# Altium schematic sheet Output.SchDoc
size A4; SheetNumber: 3; SheetTotal: 4
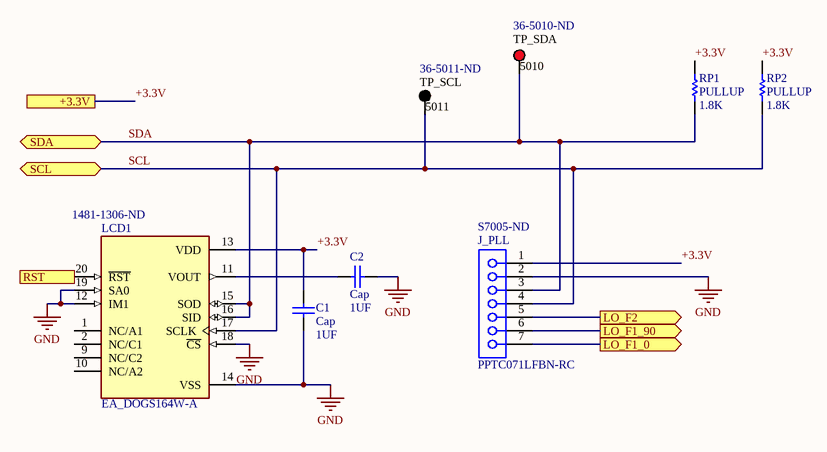
[diagram p0: Output.SchDoc]

## Parts
C1  Cap  value 1UF  [RADIAL-0.1]
C2  Cap  value 1UF  [RADIAL-0.1]
J_PLL  PPTC071LFBN-RC  Supplier Part Number 1: S7005-ND  [SMTC-SSQ-107-01-X-S]
LCD1  EA_DOGS164W-A  Supplier Part Number 1: 1481-1306-ND  [LCD_EA_DOGS164W-A]
RP1  PULLUP  value 1.8K  [AXIAL-0.1-RES]
RP2  PULLUP  value 1.8K  [AXIAL-0.1-RES]
TP_SCL  5011  Supplier Part Number 1: 36-5011-ND  [KSTN-5011_V]
TP_SDA  5010  Supplier Part Number 1: 36-5010-ND  [KSTN-5010_V]

## Ports
+3.3V, LO_F1_0 (out), LO_F1_90 (out), LO_F2 (out), RST (in), SCL (bidir), SDA (bidir)

## Nets
GND: C1.1 C2.1 J_PLL.2 LCD1.12(IM1) LCD1.14(VSS) LCD1.18(~{CS}) LCD1.19(SA0)
+3.3V: C1.2 J_PLL.1 LCD1.13(VDD) RP1.2 RP2.2 ; port +3.3V
LO_F1_0: J_PLL.7 ; port LO_F1_0
LO_F1_90: J_PLL.6 ; port LO_F1_90
LO_F2: J_PLL.5 ; port LO_F2
RST: LCD1.20(~{RST}) ; port RST
SCL: J_PLL.4 LCD1.17(SCLK) RP2.1 TP_SCL.1 ; port SCL
SDA: J_PLL.3 LCD1.15(SOD) LCD1.16(SID) RP1.1 TP_SDA.1 ; port SDA
NetC2_2: C2.2 LCD1.11(VOUT)

Not connected (* = marked no-connect by the designer): LCD1 1(NC/A1) 2(NC/C1) 9(NC/C2) 10(NC/A2)

## Library data of the parts
C1 C2 = CAP ALUM 1UF 20% 100V RADIAL: Capacitor; Manufacturer Part Number: ESE105M100AC3EA; Designator: C?; Voltage Rating: 100V; Published: 8-Jun-2000; LatestRevisionDate: 17-Jul-2002; LatestRevisionNote: Re-released for DXP Platform.; Publisher: Altium Limited
J_PLL = CMP-1023-00284-1: SQ Post Socket, Through-hole, Vertical, -55 to 125 degC, 2.54 mm Pitch, 7-Pin, Female, RoHS; PartNumber: SSQ-107-01-G-S; Manufacturer: Samtec; Manufacturer Series: PP; Pitch: 2.54 mm; Description: Board Connector, 7 Contact(s), 1 Row(s), Female, Straight, 0.1 inch Pitch, Solder Terminal, Locking; Connector Type: BOARD CONNECTOR; Contact Pattern: RECTANGULAR; Contact Style: SQ PIN-SKT; Number Of Connectors: 1; Polarization Key: POLARIZED HOUSING; Rated Current (Signal): 3A; Number of Contacts: 7; Body Breadth: 0.094inch; Body Depth: 0.334inch; Body Length: 0.72inch; Mating Contact Pitch: 0.1inch; Mounting Option 1: LOCKING; Reference Standard: UL; Reliability: COMMERCIAL; PackageDescription: Assembly, Socket Strip .025[0.64] SQ Tail; PackageReference: SSQ-107-01-X-S; ComponentLink2URL: http://www.samtec.com/documents/webfiles/pdf/SSQ_TH.PDF; ComponentLink1URL: http://www.samtec.com; ComponentLink3Description: Package Specification; PackageVersion: BD, 6/1987; RoHS: True; DatasheetVersion: F-214; Mounting Technology: Through-hole; ComponentLink3URL: http://www.samtec.com/documents/webfiles/cpdf/SSQ-1XX-XX-XXX-X-XX-XXX-XX-X-MKT.pdf; ComponentLink1Description: Manufacturer URL; Temperature Range: -55 to 125 degC; Orientation: Vertical; ComponentLink2Description: Datasheet; Supplier 1: Digikey; Manufacturer Part Number: PPTC071LFBN-RC; Category: Connectors; Stock 1: 11503; Pricing 1: 1=0.6, 10=0.52, 80=0.42913, 440=0.37309, 1000=0.30781, 5000=0.2705, 10000=0.2665 (USD); Mount: Board; Contact Material: Bronze; Contact Finish - Mating: SN; Contact Finish - Termination: TIN; Insulation Material: Polyester; Contact Gender: Female; Mounting Style: STRAIGHT; Number Of PCB Rows: 1; Number of Rows Loaded: 1; PCB Contact Pattern: RECTANGULAR; Termination: Solder; Terminal Length: 0.125inch; Terminal Pitch: 2.54mm; Reach SVHC Compliant: Yes; RoHS Compliant: Yes; ComponentLink4URL: https://datasheet.ciiva.com:443/pdfs/VipMasterIC/IC/SUCS/SUCSS00270/SUCSS00270-1.pdf?src-supplier=IHS+Markit; ComponentLink4Description: https://datasheet.ciiva.com:443/pdfs/VipMasterIC/IC/SUCS/SUCSS00270/SUCSS00270-1.pdf?src-supplier=IHS+Markit; ComponentLink5URL: https://media.digikey.com/pdf/Data%20Sheets/Sullins%20PDFs/Female_Headers.100_DS.pdf?src-supplier=Digikey; ComponentLink5Description: https://media.digikey.com/pdf/Data%20Sheets/Sullins%20PDFs/Female_Headers.100_DS.pdf?src-supplier=Digikey; ComponentLink6URL: http://www.sullinscorp.com/catalogs/78_Page80-81_HEADER_.100_2.54mm_FEMALE.pdf?src-supplier=Future+Electronics; ComponentLink6Description: http://www.sullinscorp.com/catalogs/78_Page80-81_HEADER_.100_2.54mm_FEMALE.pdf?src-supplier=Future+Electronics
LCD1 = EA_DOGS164W-A: LCM char. 4x16 FSTN White Transflective EA DOGS164W-A; MF: Display Visions; Value: *; Check_prices: https://www.snapeda.com/parts/EA%20DOGS164W-A/Focus+Display+Solutions/view-part/?ref=eda; Price: None; MP: EA DOGS164W-A; SnapEDA_Link: https://www.snapeda.com/parts/EA%20DOGS164W-A/Focus+Display+Solutions/view-part/?ref=snap; Purchase-URL: https://pricing.snapeda.com/search/part/EA DOGS164W-A/?ref=eda; Package: None; Availability: In Stock; Supplier 1: Digikey; Manufacturer: Display Visions; Manufacturer Part Number: EADOGS164W-A; RoHS: No; Category: Uncategorized; Stock 1: 178; Pricing 1: 1=8.31, 10=6.026, 100=4.9791, 500=4.36068, 1000=4.12282, 2000=4.02768 (USD)
RP1 RP2 = RES 1.8K OHM 5% 1/4W AXIAL: Resistor; Manufacturer Part Number: CFR-25JB-52-1K8; Designator: R?; Power Rating: 1/4W; Tolerance: 0.05; Published: 8-Jun-2000; LatestRevisionDate: 17-Jul-2002; LatestRevisionNote: Re-released for DXP Platform.; Publisher: Altium Limited
TP_SCL = CMP-1672-00003-4: Test Point, Black, Through Hole, RoHS, Bulk; Manufacturer: Keystone; Description: Interconnection Device; ComponentLink2URL: http://www.keyelco.com/product-pdf.cfm?p=1320; Colour: Black; Pins: 1; REACH SVHC: No SVHC; ComponentLink1URL: http://www.keyelco.com/; PackageReference: 5011; Contact Plating: Silver; Package Quantity: 100; Packaging: Bulk; RoHSCompliant: true; Height: 8.12 mm; PackageDescription: 1-Pin Through Hole Device, Dia 3.17 mm; Mount: Through Hole; Mounting Technology: Through Hole; DatasheetVersion: Rev. F, 12/2013; ComponentLink1Description: Manufacturer URL; Contact Material: Bronze; ComponentLink2Description: Datasheet; Supplier 1: Digikey; Manufacturer Part Number: 5011; RoHS: Yes; Category: Connectors; Stock 1: 173174; Pricing 1: 1=0.38, 25=0.308, 100=0.3015, 250=0.28304, 500=0.2523, 1000=0.17746, 2500=0.16225, 5000=0.15211 (USD); Connector Type: Interconnection Device; Reach SVHC Compliant: Yes; RoHS Compliant: Yes; ComponentLink3URL: https://datasheet.ciiva.com:443/pdfs/VipMasterIC/IC/KEYC/KEYC-S-A0000709140/KEYC-S-A0000709140-1.pdf?src-supplier=IHS+Markit; ComponentLink3Description: https://datasheet.ciiva.com:443/pdfs/VipMasterIC/IC/KEYC/KEYC-S-A0000709140/KEYC-S-A0000709140-1.pdf?src-supplier=IHS+Markit; ComponentLink4URL: https://datasheet.ciiva.com/1454/1718230-1454834.pdf?src-supplier=Element14; ComponentLink4Description: https://datasheet.ciiva.com/1454/1718230-1454834.pdf?src-supplier=Element14; ComponentLink5URL: https://datasheet.ciiva.com/11744/0900766b8009b7c7-11744935.pdf?src-supplier=Rs; ComponentLink5Description: https://datasheet.ciiva.com/11744/0900766b8009b7c7-11744935.pdf?src-supplier=Rs; ComponentLink6URL: https://datasheet.ciiva.com/2917/5011-2917635.pdf?src-supplier=Digikey; ComponentLink6Description: https://datasheet.ciiva.com/2917/5011-2917635.pdf?src-supplier=Digikey; ComponentLink7URL: https://datasheet.ciiva.com/16351/m60-2p60-16351093.pdf?src-supplier=Future+Electronics; ComponentLink7Description: https://datasheet.ciiva.com/16351/m60-2p60-16351093.pdf?src-supplier=Future+Electronics; ComponentLink8URL: https://datasheet.ciiva.com/46412/1703983-46412138.pdf?src-supplier=Element14; ComponentLink8Description: https://datasheet.ciiva.com/46412/1703983-46412138.pdf?src-supplier=Element14
TP_SDA = CMP-1672-00002-4: Test Point, Red, Through Hole, RoHS, Bulk; Manufacturer: Keystone; Description: Interconnection Device; Contact Material: Bronze; Mounting Technology: Through Hole; RoHSCompliant: true; Pins: 1; Package Quantity: 100; ComponentLink2Description: Datasheet; Height: 8.12 mm; ComponentLink1URL: http://www.keyelco.com/; DatasheetVersion: Rev. F, 12/2013; Mount: Through Hole; PackageReference: 5010; Contact Plating: Silver; Packaging: Bulk; Colour: Red; REACH SVHC: No SVHC; PackageDescription: 1-Pin Through Hole Device, Dia 3.17 mm; ComponentLink2URL: http://www.keyelco.com/product-pdf.cfm?p=1319; ComponentLink1Description: Manufacturer URL; Supplier 1: Digikey; Manufacturer Part Number: 5010; RoHS: Yes; Category: Connectors; Stock 1: 226312; Pricing 1: 1=0.38, 25=0.308, 100=0.3015, 250=0.28304, 500=0.2523, 1000=0.17746, 2500=0.16225, 5000=0.15211 (USD); Contact Finish - Termination: Silver (Ag); Connector Type: Interconnection Device; JESD-609 Code: e4; Reach SVHC Compliant: Yes; RoHS Compliant: Yes; ComponentLink3URL: https://datasheet.ciiva.com:443/pdfs/VipMasterIC/IC/KEYC/KEYC-S-A0000709033/KEYC-S-A0000709033-1.pdf?src-supplier=IHS+Markit; ComponentLink3Description: https://datasheet.ciiva.com:443/pdfs/VipMasterIC/IC/KEYC/KEYC-S-A0000709033/KEYC-S-A0000709033-1.pdf?src-supplier=IHS+Markit; ComponentLink4URL: https://datasheet.ciiva.com/11744/0900766b8009b7c7-11744920.pdf?src-supplier=Rs; ComponentLink4Description: https://datasheet.ciiva.com/11744/0900766b8009b7c7-11744920.pdf?src-supplier=Rs; ComponentLink5URL: https://datasheet.ciiva.com/1454/1703983-1454833.pdf?src-supplier=Element14; ComponentLink5Description: https://datasheet.ciiva.com/1454/1703983-1454833.pdf?src-supplier=Element14; ComponentLink6URL: https://datasheet.ciiva.com/22631/1703983-22631113.pdf?src-supplier=Element14; ComponentLink6Description: https://datasheet.ciiva.com/22631/1703983-22631113.pdf?src-supplier=Element14; ComponentLink7URL: https://datasheet.ciiva.com/16883/70182825-16883886.pdf?src-supplier=Allied+Electronics; ComponentLink7Description: https://datasheet.ciiva.com/16883/70182825-16883886.pdf?src-supplier=Allied+Electronics; ComponentLink8URL: https://datasheet.ciiva.com/16506/m60-2p60-16506972.pdf?src-supplier=Future+Electronics; ComponentLink8Description: https://datasheet.ciiva.com/16506/m60-2p60-16506972.pdf?src-supplier=Future+Electronics; ComponentLink9URL: https://datasheet.ciiva.com/2917/5010-2917626.pdf?src-supplier=Digikey; ComponentLink9Description: https://datasheet.ciiva.com/2917/5010-2917626.pdf?src-supplier=Digikey